# EAGLE design stm32f103c8t6_core_logic_board (EAGLE 8.2.0)
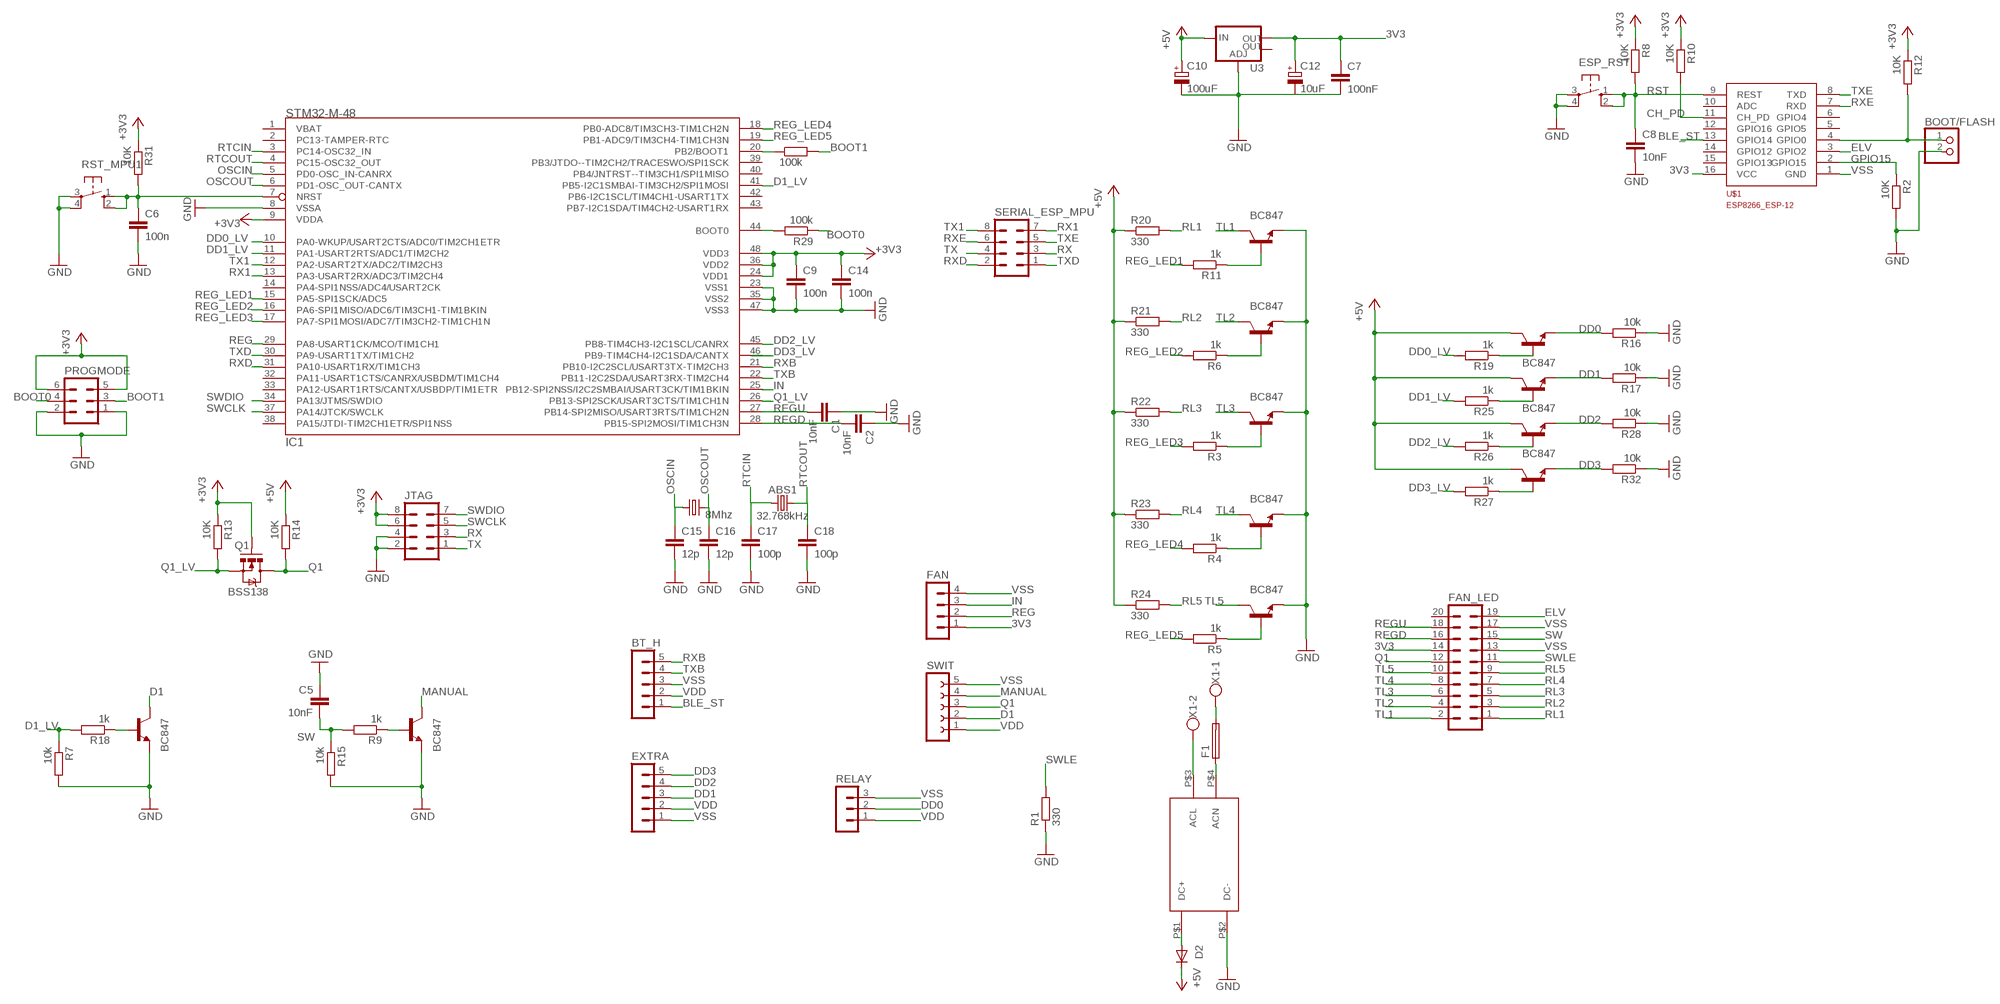
[diagram p0: schematic, sheet 1]

## Parts
ABS1  32.768kHz  CRYSTAL-32.768KHZPTH-2X6  [CRYSTAL-PTH-2X6-CYL]
BOOT/FLASH  PINHD-1X2  [1X02]
BT_H  MA05-1  [MA05-1]
C1  10nF  C-EUC1206  [C1206]
C2  10nF  C-EUC1206  [C1206]
C5  10nF  C-EUC1206  [C1206]
C6  100n  C-EUC1206  [C1206]
C7  100nF  C-EUC1206  [C1206]
C8  10nF  C-EUC1206  [C1206]
C9  100n  C-EUC1206  [C1206]
C10  100uF  CPOL-EU153CLV-0605  [153CLV-0605]
C12  10uF  CPOL-EU153CLV-0405  [153CLV-0405]
C14  100n  C-EUC1206  [C1206]
C15  12p  C-EUC1206  [C1206]
C16  12p  C-EUC1206  [C1206]
C17  100p  C-EUC1206  [C1206]
C18  100p  C-EUC1206  [C1206]
D1_C  BC847  [SOT23]
D1_C1  BC847  [SOT23]
D2  1N4004  [DO41-10]
DD0_C  BC847  [SOT23]
DD1_C  BC847  [SOT23]
DD2_C  BC847  [SOT23]
DD3_C  BC847  [SOT23]
ESP_RST  10-XX  [B3F-10XX]
EXTRA  MA05-1  [MA05-1]
F1  SH22,5A  [SH22,5A]
FAN  MA04-1  [MA04-1]
FAN_LED  MA10-2  [MA10-2]
IC1  STM32-M-48  [LQFP48]
JTAG  MA04-2  [MA04-2]
L1  BC847  [SOT23]
L2  BC847  [SOT23]
L3  BC847  [SOT23]
L4  BC847  [SOT23]
L5  BC847  [SOT23]
PROGMODE  MA03-2  [MA03-2]
Q1  BSS138  MOSFET-NCHANNELSMD  [SOT23-3]
Q2  8Mhz  CRYSTALHC49U-V  [HC49U-V]
R1  330  R-EU_R1206  [R1206]
R2  10K  R-EU_R1206  [R1206]
R3  1k  R-EU_M1206  [M1206]
R4  1k  R-EU_M1206  [M1206]
R5  1k  R-EU_M1206  [M1206]
R6  1k  R-EU_M1206  [M1206]
R7  10k  R-EU_M1206  [M1206]
R8  10K  R-EU_R1206  [R1206]
R9  1k  R-EU_M1206  [M1206]
R10  10K  R-EU_R1206  [R1206]
R11  1k  R-EU_M1206  [M1206]
R12  10K  R-EU_R1206  [R1206]
R13  10K  R-EU_R1206  [R1206]
R14  10K  R-EU_R1206  [R1206]
R15  10k  R-EU_M1206  [M1206]
R16  10k  R-EU_M1206  [M1206]
R17  10k  R-EU_M1206  [M1206]
R18  1k  R-EU_M1206  [M1206]
R19  1k  R-EU_M1206  [M1206]
R20  330  R-EU_R1206  [R1206]
R21  330  R-EU_R1206  [R1206]
R22  330  R-EU_R1206  [R1206]
R23  330  R-EU_R1206  [R1206]
R24  330  R-EU_R1206  [R1206]
R25  1k  R-EU_M1206  [M1206]
R26  1k  R-EU_M1206  [M1206]
R27  1k  R-EU_M1206  [M1206]
R28  10k  R-EU_M1206  [M1206]
R29  100k  R-EU_R1206  [R1206]
R30  100k  R-EU_R1206  [R1206]
R31  10K  R-EU_R1206  [R1206]
R32  10k  R-EU_M1206  [M1206]
RELAY  MA03-1  [MA03-1]
RST_MPU1  10-XX  [B3F-10XX]
SERIAL_ESP_MPU  MA04-2  [MA04-2]
SWIT  FE05-1  [FE05-1]
U3  V_REG_LM1117SOT223  [SOT223]
U$1  ESP8266_ESP-12  [ESP8266-ESP12]
U$2  SDOWN_POWER_SUPPLYPOWER_SUPPLY  [SDOWN_POWER_SUPPLY]
X1  W237-102  [W237-102]

## Nets
3V3: C7.1 C9.1 C12.+ C14.1 FAN.1 FAN_LED.14 IC1.9(VDDA) IC1.24(VDD1) IC1.36(VDD2) IC1.48(VDD3) JTAG.6 JTAG.8 PROGMODE.5 PROGMODE.6 Q1.1(G) R8.1 R10.1 R12.1 R13.1 R31.1 U3.2(OUT) U$1.16(VCC) ; supply symbol labelled +3V3
BLE_ST: BT_H.1 U$1.13(GPIO14)
BOOT0: PROGMODE.4 R29.1
BOOT1: PROGMODE.3 R30.2
CH_PD: R10.2 U$1.11(CH_PD)
D1: D1_C.3(C) SWIT.2
D1_LV: IC1.41(PB5-I2C1SMBAI-TIM3CH2/SPI1MOSI) R7.1 R18.2
DD0: DD0_C.2(E) R16.2 RELAY.2
DD0_LV: IC1.10(PA0-WKUP/USART2CTS/ADC0/TIM2CH1ETR) R19.2
DD1: DD1_C.2(E) EXTRA.3 R17.2
DD1_LV: IC1.11(PA1-USART2RTS/ADC1/TIM2CH2) R25.2
DD2: DD2_C.2(E) EXTRA.4 R28.2
DD2_LV: IC1.45(PB8-TIM4CH3-I2C1SCL/CANRX) R26.2
DD3: DD3_C.2(E) EXTRA.5 R32.2
DD3_LV: IC1.46(PB9-TIM4CH4-I2C1SDA/CANTX) R27.2
ELV: FAN_LED.19 U$1.3(GPIO2)
GPIO0: BOOT/FLASH.1 R12.2 U$1.4(GPIO0)
GPIO15: R2.1 U$1.2(GPIO15)
IN: FAN.3 IC1.25(PB12-SPI2NSS/I2C2SMBAI/USART3CK/TIM1BKIN)
MANUAL: D1_C1.3(C) SWIT.4
N$1: L1.1(B) R11.1
N$2: IC1.44(BOOT0) R29.2
N$3: L2.1(B) R6.1
N$4: L3.1(B) R3.1
N$5: D2.A U$2.P$1(DC+)
N$6: L4.1(B) R4.1
N$7: L5.1(B) R5.1
N$8: F1.2 X1.1
N$9: F1.1 U$2.P$4(ACN)
N$10: U$2.P$3(ACL) X1.2
N$15: D1_C.1(B) R18.1
N$16: IC1.20(PB2/BOOT1) R30.1
N$17: D1_C1.1(B) R9.1
N$23: DD0_C.1(B) R19.1
N$26: DD1_C.1(B) R25.1
N$28: DD2_C.1(B) R26.1
N$31: DD3_C.1(B) R27.1
OSCIN: C15.1 IC1.5(PD0-OSC_IN-CANRX) Q2.1
OSCOUT: C16.1 IC1.6(PD1-OSC_OUT-CANTX) Q2.2
Q1: FAN_LED.12 Q1.3(D) R14.2 SWIT.3
Q1_LV: IC1.26(PB13-SPI2SCK/USART3CTS/TIM1CH1N) Q1.2(S) R13.2
REG: FAN.2 IC1.29(PA8-USART1CK/MCO/TIM1CH1)
REG_LED1: IC1.15(PA5-SPI1SCK/ADC5) R11.2
REG_LED2: IC1.16(PA6-SPI1MISO/ADC6/TIM3CH1-TIM1BKIN) R6.2
REG_LED3: IC1.17(PA7-SPI1MOSI/ADC7/TIM3CH2-TIM1CH1N) R3.2
REG_LED4: IC1.18(PB0-ADC8/TIM3CH3-TIM1CH2N) R4.2
REG_LED5: IC1.19(PB1-ADC9/TIM3CH4-TIM1CH3N) R5.2
REGD: C2.2 FAN_LED.16 IC1.28(PB15-SPI2MOSI/TIM1CH3N)
REGU: C1.2 FAN_LED.18 IC1.27(PB14-SPI2MISO/USART3RTS/TIM1CH2N)
RESET1: C6.1 IC1.7(NRST) R31.2 RST_MPU1.1(S) RST_MPU1.2(S1)
RL1: FAN_LED.1 R20.2
RL2: FAN_LED.3 R21.2
RL3: FAN_LED.5 R22.2
RL4: FAN_LED.7 R23.2
RL5: FAN_LED.9 R24.2
RST: C8.1 ESP_RST.1(S) ESP_RST.2(S1) R8.2 U$1.9(REST)
RTCIN: ABS1.1 C17.1 IC1.3(PC14-OSC32_IN)
RTCOUT: ABS1.2 C18.1 IC1.4(PC15-OSC32_OUT)
RX: JTAG.3 SERIAL_ESP_MPU.3
RX1: IC1.13(PA3-USART2RX/ADC3/TIM2CH4) SERIAL_ESP_MPU.7
RXB: BT_H.5 IC1.21(PB10-I2C2SCL/USART3TX-TIM2CH3)
RXD: IC1.31(PA10-USART1RX/TIM1CH3) SERIAL_ESP_MPU.2
RXE: SERIAL_ESP_MPU.6 U$1.7(RXD)
SW: C5.2 FAN_LED.15 R9.2 R15.1
SWCLK: IC1.37(PA14/JTCK/SWCLK) JTAG.5
SWDIO: IC1.34(PA13/JTMS/SWDIO) JTAG.7
SWLE: FAN_LED.11 R1.2
TL1: FAN_LED.2 L1.3(C)
TL2: FAN_LED.4 L2.3(C)
TL3: FAN_LED.6 L3.3(C)
TL4: FAN_LED.8 L4.3(C)
TL5: FAN_LED.10 L5.3(C)
TX: JTAG.1 SERIAL_ESP_MPU.4
TX1: IC1.12(PA2-USART2TX/ADC2/TIM2CH3) SERIAL_ESP_MPU.8
TXB: BT_H.4 IC1.22(PB11-I2C2SDA/USART3RX-TIM2CH4)
TXD: IC1.30(PA9-USART1TX/TIM1CH2) SERIAL_ESP_MPU.1
TXE: SERIAL_ESP_MPU.5 U$1.8(TXD)
VDD: BT_H.2 C10.+ D2.C DD0_C.3(C) DD1_C.3(C) DD2_C.3(C) DD3_C.3(C) EXTRA.2 R14.1 R20.1 R21.1 R22.1 R23.1 R24.1 RELAY.1 SWIT.1 U3.3(IN) ; supply symbol labelled +5V
VSS: BOOT/FLASH.2 BT_H.3 C1.1 C2.1 C5.1 C6.2 C7.2 C8.2 C9.2 C10.- C12.- C14.2 C15.2 C16.2 C17.2 C18.2 D1_C1.2(E) D1_C.2(E) ESP_RST.3(P) ESP_RST.4(P1) EXTRA.1 FAN.4 FAN_LED.13 FAN_LED.17 IC1.8(VSSA) IC1.23(VSS1) IC1.35(VSS2) IC1.47(VSS3) JTAG.2 JTAG.4 L1.2(E) L2.2(E) L3.2(E) L4.2(E) L5.2(E) PROGMODE.1 PROGMODE.2 R1.1 R2.2 R7.2 R15.2 R16.1 R17.1 R28.1 R32.1 RELAY.3 RST_MPU1.3(P) RST_MPU1.4(P1) SWIT.5 U3.1(ADJ) U$1.1(GND) U$2.P$2(DC-) ; supply symbol labelled GND
Unconnected: FAN_LED.20 IC1.1(VBAT) IC1.2(PC13-TAMPER-RTC) IC1.14(PA4-SPI1NSS/ADC4/USART2CK) IC1.32(PA11-USART1CTS/CANRX/USBDM/TIM1CH4) IC1.33(PA12-USART1RTS/CANTX/USBDP/TIM1ETR) IC1.38(PA15/JTDI-TIM2CH1ETR/SPI1NSS) IC1.39(PB3/JTDO--TIM2CH2/TRACESWO/SPI1SCK) IC1.40(PB4/JNTRST--TIM3CH1/SPI1MISO) IC1.42(PB6-I2C1SCL/TIM4CH1-USART1TX) IC1.43(PB7-I2C1SDA/TIM4CH2-USART1RX) U3.4(OUT) U$1.5(GPIO5) U$1.6(GPIO4) U$1.10(ADC) U$1.12(GPIO16) U$1.14(GPIO12) U$1.15(GPIO13)

## Library data of the parts
ABS1 = SparkFun-Clocks:CRYSTAL-32.768KHZ: 32.768kHz Crystal Frequency: 32.768kHz Frequency Stability: ±20ppm Load Capacitance: 12.5pF (PTH-2X6 & SMD-3.2X1.5), 6pF (SMD-2X6) SparkFun Products: SparkFun BigTime Watch Kit <https://www.sparkfun.com/products/11734> SparkFun nRF52832 Breakout <https://www.sparkfun.com/products/13990> SparkFun Real Time Clock Module <https://www.sparkfun.com/products/12708>; PROD_ID: XTAL-10112
BOOT/FLASH = pinhead:PINHD-1X2: PIN HEADER
BT_H EXTRA = con-lstb:MA05-1: PIN HEADER; OC_FARNELL: unknown; OC_NEWARK: unknown
C1 C2 C5-C9 C14-C18 = rcl:C-EU: CAPACITOR, European symbol
C10 C12 = resistor:CPOL-EU: POLARIZED CAPACITOR, European symbol
D1_C D1_C1 DD0_C DD1_C DD2_C DD3_C L1-L5 = transistor:BC847: NPN TRANSISTOR
D2 = diode:1N4004: DIODE general purpose rectifier, 1 A
ESP_RST RST_MPU1 = switch-omron:10-XX: OMRON SWITCH; MPN: B3F-1000; OC_FARNELL: 176432; OC_NEWARK: 36M3542
F1 = fuse:SH22,5A: FUSE HOLDER grid 22,5mm, isolated cap OGN0031 8201, Schurter (Buerklin); MPN: 0031.7701.11; OC_FARNELL: unknown; OC_NEWARK: 04F1224
FAN = con-lstb:MA04-1: PIN HEADER; OC_FARNELL: unknown; OC_NEWARK: unknown
FAN_LED = con-lstb:MA10-2: PIN HEADER; OC_FARNELL: unknown; OC_NEWARK: unknown
IC1 = pel_stm32:STM32-M-48: STM32F103 Medium Density 48pins
JTAG SERIAL_ESP_MPU = con-lstb:MA04-2: PIN HEADER; OC_FARNELL: unknown; OC_NEWARK: unknown
PROGMODE = con-lstb:MA03-2: PIN HEADER; OC_FARNELL: unknown; OC_NEWARK: unknown
Q1 = SparkFun:MOSFET-NCHANNEL
Q2 = crystal:CRYSTAL: CRYSTAL; OC_FARNELL: 1666969; OC_NEWARK: unknown
R1 R2 R8 R10 R12-R14 R20-R24 R29-R31 = rcl:R-EU_: RESISTOR, European symbol
R3-R7 R9 R11 R15-R19 R25-R28 R32 = resistor:R-EU_: RESISTOR, European symbol
RELAY = con-lstb:MA03-1: PIN HEADER; OC_FARNELL: unknown; OC_NEWARK: unknown
SWIT = con-lsta:FE05-1: FEMALE HEADER; OC_FARNELL: unknown; OC_NEWARK: unknown
U3 = SparkFun-PowerIC:V_REG_LM1117: Voltage Regulator LM1117 Standard adjustable voltage regulator but in SMD form. Spark Fun Electronics SKU : COM-00595; PROD_ID: VREG-08170
U$1 = ESP8266-ESP12:ESP8266_ESP-12
U$2 = SDOWN_POWER_SUPPLY:SDOWN_POWER_SUPPLY
X1 = con-wago-500:W237-102: WAGO SCREW CLAMP; MPN: 237-102; OC_FARNELL: unknown; OC_NEWARK: 70K9898

## Net classes
0 default: clearance 0.205 mm
1 POWER: clearance 0.205 mm to class 0, clearance 0.205 mm
2 GND: clearance 0.205 mm to class 0, clearance 0.205 mm to class 1, clearance 0.205 mm

## Board
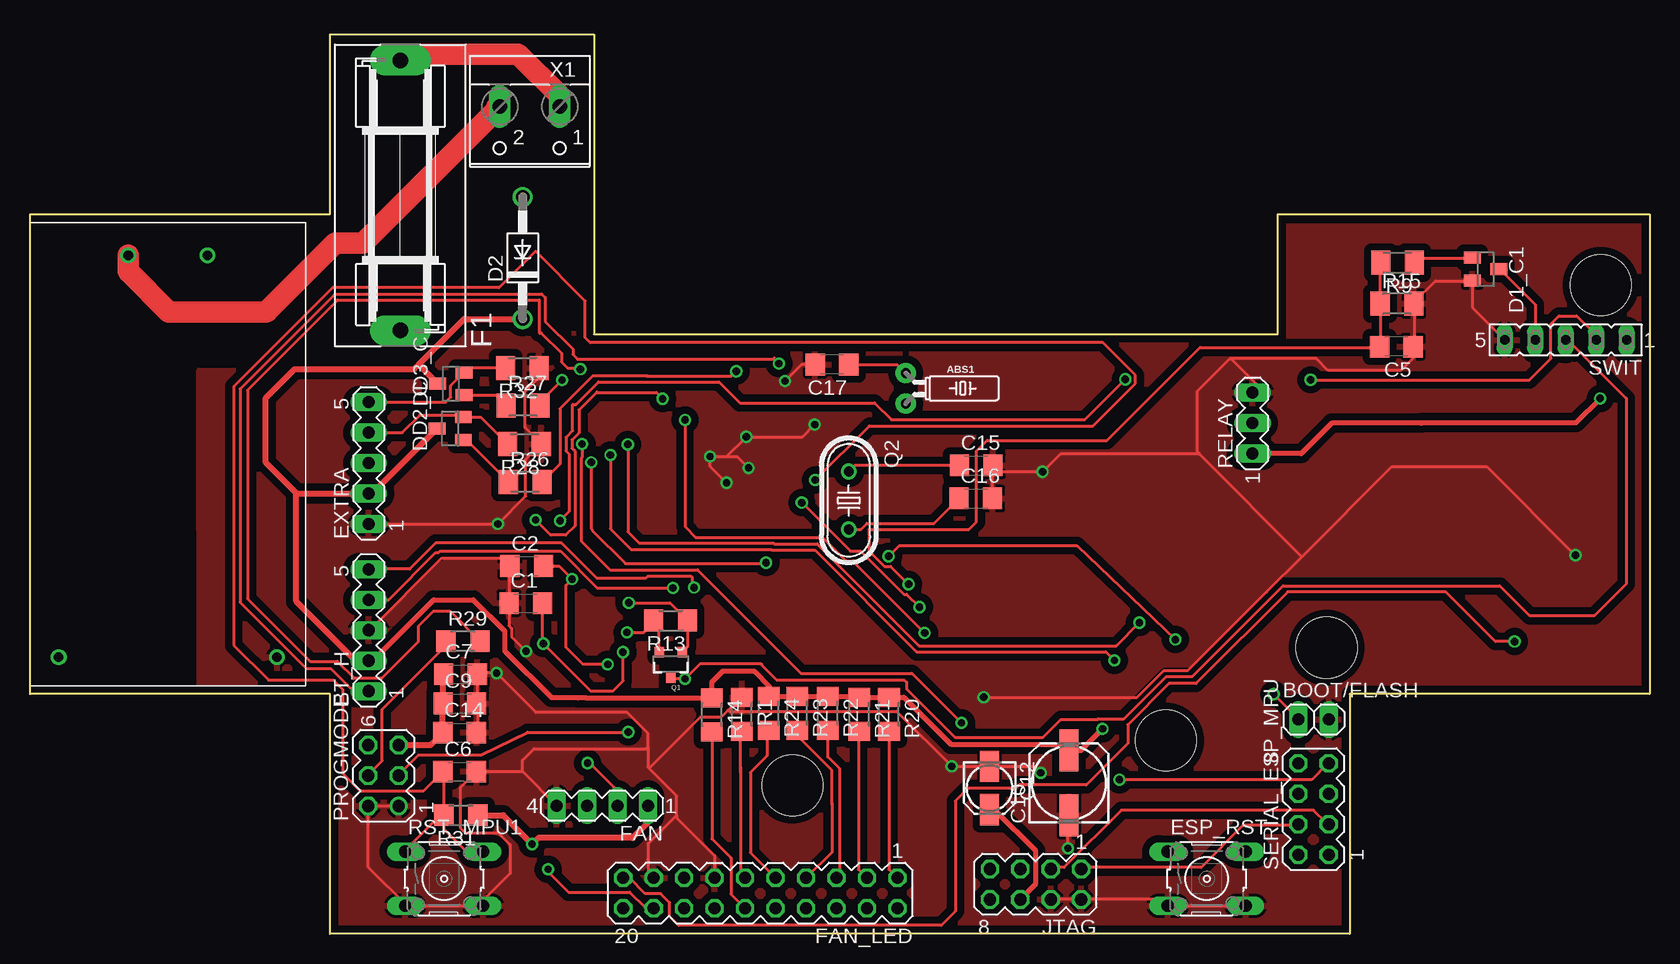
[diagram p1: board, top side]
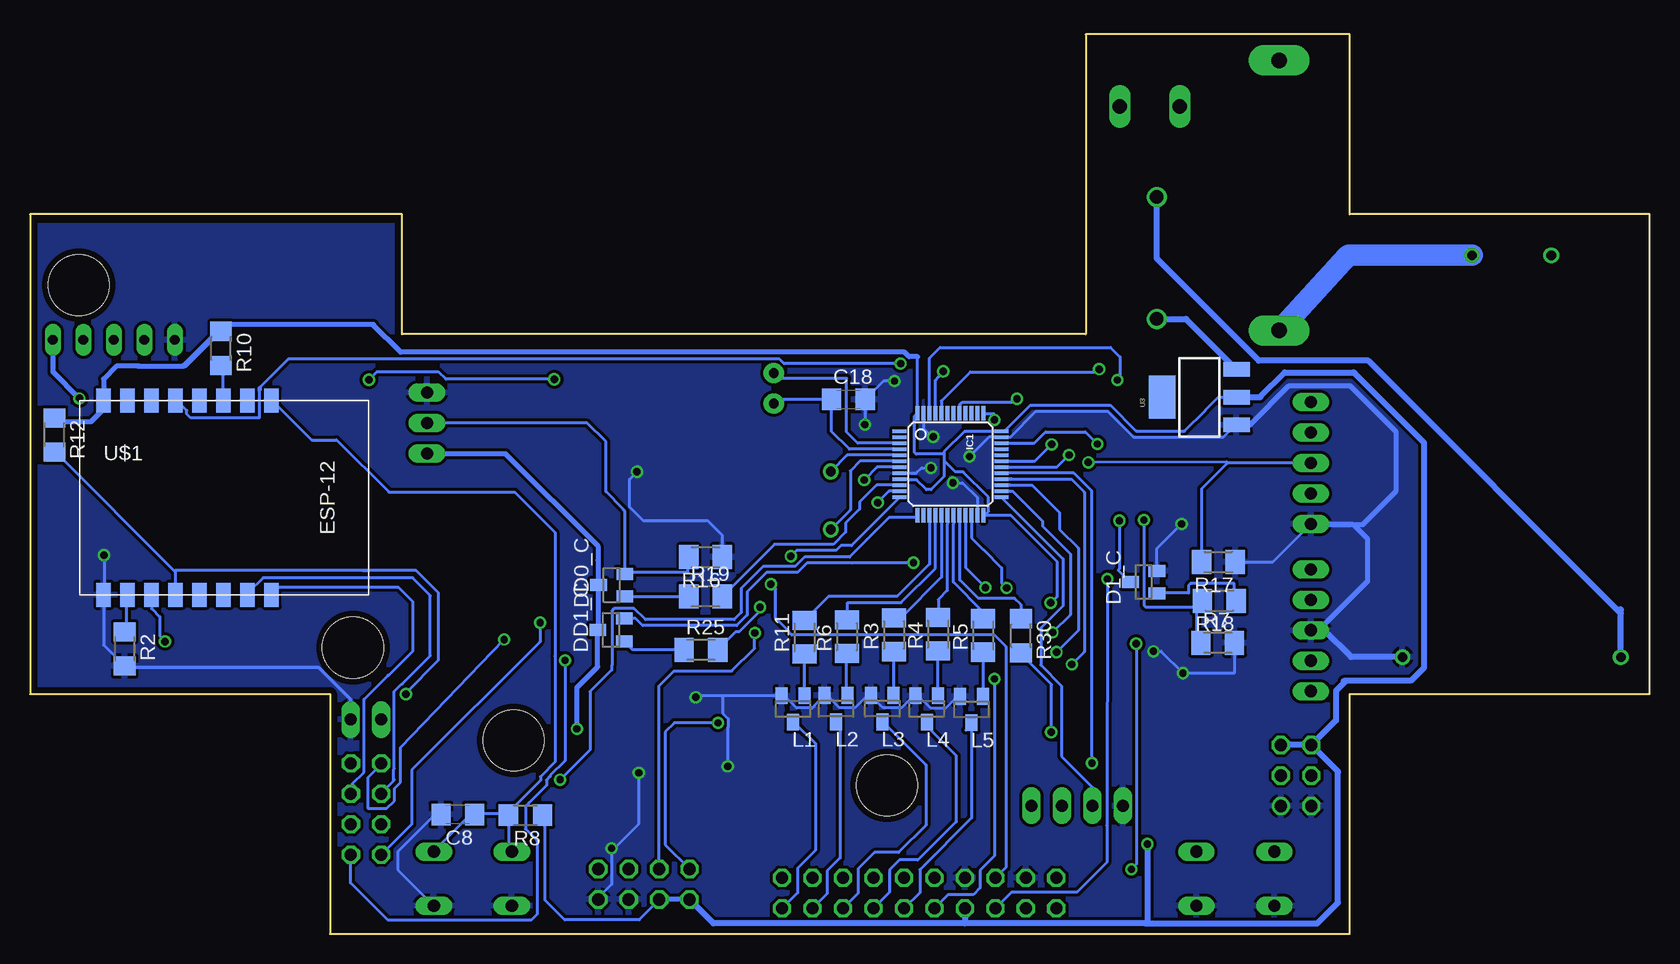
[diagram p2: board, bottom side, seen from below]

Size 135 x 75 mm. Coordinates in mm from the lower left corner, seen from the top.
Outline: 25,0 25,20 0,20 0,60 25,60 25,75 47,75 47,50 104,50 104,60 135,60 135,20 110,20 110,0 25,0
Copper layers (1*16): Top 0.035mm / dielectric 1.5mm / Bottom 0.035mm
Design rules "default *": minimum track width 10mil, minimum drill 24mil, track to track 10mil, track to pad 8mil, pad to pad 8mil, via to via 8mil, smd to smd 6mil, copper to edge 20mil, drill to drill 10mil, minimum pad ring 10mil, minimum via ring 8mil, stop-mask expansion 4mil, vias tented up to drill 0mil, thermal gap 10mil
Holes 5.08 mm at 130.94,54.1 108.08,23.88 63.55,12.4 94.69,16.13

### Footprints (pad centres in the part's own frame; a part is rotated, then mirrored left to right if it is on the bottom)
CRYSTAL-PTH-2X6-CYL = drill 0.813 pad 1.676: 1 -1.27,0; 2 1.27,0
1X02 = drill 1.016 long: 1 -1.27,0; 2 1.27,0
MA05-1 = drill 1.016 long: 1 -5.08,0; 2 -2.54,0; 3 0,0; 4 2.54,0; 5 5.08,0
C1206 = smd 1.6 x 1.8: 1 -1.4,0; 2 1.4,0
153CLV-0605 = smd 3.5 x 1.6: + 2.7,0; - -2.7,0
153CLV-0405 = smd 2.6 x 1.6: + 1.8,0; - -1.8,0
SOT23 = smd 1 x 1.4: 1 -0.95,-1.1; 2 0.95,-1.1; 3 0,1.1
DO41-10 = drill 1.118: A 5.08,0; C -5.08,0
B3F-10XX = drill 1.016 long: 1 -3.251,2.261; 2 3.251,2.261; 3 -3.251,-2.261; 4 3.251,-2.261
SH22,5A = drill 1.321 pad 2.54 long: 1 -11.252,0; 2 11.252,0
MA04-1 = drill 1.016 long: 1 -3.81,0; 2 -1.27,0; 3 1.27,0; 4 3.81,0
MA10-2 = drill 1.016 octagon: 1 -11.43,-1.27; 2 -11.43,1.27; 3 -8.89,-1.27; 4 -8.89,1.27; 5 -6.35,-1.27; 6 -6.35,1.27; 7 -3.81,-1.27; 8 -3.81,1.27; 9 -1.27,-1.27; 10 -1.27,1.27; 11 1.27,-1.27; 12 1.27,1.27; 13 3.81,-1.27; 14 3.81,1.27; 15 6.35,-1.27; 16 6.35,1.27; 17 8.89,-1.27; 18 8.89,1.27; 19 11.43,-1.27; 20 11.43,1.27
LQFP48 = smd 0.3 x 1.2: 1 -2.75,-4.25; 2 -2.25,-4.25; 3 -1.75,-4.25; 4 -1.25,-4.25; 5 -0.75,-4.25; 6 -0.25,-4.25; 7 0.25,-4.25; 8 0.75,-4.25; 9 1.25,-4.25; 10 1.75,-4.25; 11 2.25,-4.25; 12 2.75,-4.25; 25 2.75,4.25; 26 2.25,4.25; 27 1.75,4.25; 28 1.25,4.25; 29 0.75,4.25; 30 0.25,4.25; 31 -0.25,4.25; 32 -0.75,4.25; 33 -1.25,4.25; 34 -1.75,4.25; 35 -2.25,4.25; 36 -2.75,4.25 | smd 1.2 x 0.3: 13 4.25,-2.75; 14 4.25,-2.25; 15 4.25,-1.75; 16 4.25,-1.25; 17 4.25,-0.75; 18 4.25,-0.25; 19 4.25,0.25; 20 4.25,0.75; 21 4.25,1.25; 22 4.25,1.75; 23 4.25,2.25; 24 4.25,2.75; 37 -4.25,2.75; 38 -4.25,2.25; 39 -4.25,1.75; 40 -4.25,1.25; 41 -4.25,0.75; 42 -4.25,0.25; 43 -4.25,-0.25; 44 -4.25,-0.75; 45 -4.25,-1.25; 46 -4.25,-1.75; 47 -4.25,-2.25; 48 -4.25,-2.75
MA04-2 = drill 1.016 octagon: 1 -3.81,-1.27; 2 -3.81,1.27; 3 -1.27,-1.27; 4 -1.27,1.27; 5 1.27,-1.27; 6 1.27,1.27; 7 3.81,-1.27; 8 3.81,1.27
MA03-2 = drill 1.016: 1 -2.54,-1.27 | drill 1.016 octagon: 2 -2.54,1.27; 3 0,-1.27; 4 0,1.27; 5 2.54,-1.27; 6 2.54,1.27
SOT23-3 = smd 0.8 x 0.9: 1 -0.95,-1; 2 0.95,-1; 3 0,1.1
HC49U-V = drill 0.813: 1 -2.413,0; 2 2.413,0
R1206 = smd 1.6 x 1.803: 1 -1.422,0; 2 1.422,0
M1206 = smd 1.6 x 2: 1 -1.4,0; 2 1.4,0
MA03-1 = drill 1.016 long: 1 -2.54,0; 2 0,0; 3 2.54,0
FE05-1 = drill 0.813 long: 1 -5.08,0; 2 -2.54,0; 3 0,0; 4 2.54,0; 5 5.08,0
SOT223 = smd 1.219 x 2.235: 1 -2.311,-3.099; 2 0,-3.099; 3 2.311,-3.099 | smd 3.6 x 2.2: 4 0,3.099
ESP8266-ESP12 = smd 2 x 1.2: 1 16.2,2; 2 16.2,4; 3 16.2,6; 4 16.2,8; 5 16.2,10; 6 16.2,12; 7 16.2,14; 8 16.2,16; 9 0,16; 10 0,14; 11 0,12; 12 0,10; 13 0,8; 14 0,6; 15 0,4; 16 0,2
SDOWN_POWER_SUPPLY = drill 0.8: P$1 2.4,2.4; P$2 20.6,2.4; P$3 8.2,35.9; P$4 14.8,35.9
W237-102 = drill 1.194 long: 1 -2.5,-1.27; 2 2.5,-1.27

### Placement (x,y rotation side)
ABS1  73,45.49 270 top
BOOT/FLASH  107.01,17.88 0 top
BT_H  28.23,25.32 90 top
C1  41.33,27.58 0 top
C2  41.4,30.68 0 top
C5  113.89,48.97 180 top
C6  35.81,13.54 0 top
C7  35.89,21.67 0 top
C8  99.34,9.96 180 bottom
C9  35.84,19.23 0 top
C10  86.61,12.6 90 top
C12  79.98,12.17 270 top
C14  35.81,16.79 0 top
C15  78.87,39.07 0 top
C16  78.84,36.32 0 top
C17  66.85,47.47 180 top
C18  66.78,44.58 0 bottom
D1_C  42.16,29.34 90 bottom
D1_C1  121.34,55.42 270 top
D2  41.07,56.36 90 top
DD0_C  86.51,29.08 90 bottom
DD1_C  86.56,25.35 90 bottom
DD2_C  35.03,42.14 90 top
DD3_C  35.08,45.87 90 top
ESP_RST  98.09,4.61 0 top
EXTRA  28.23,39.26 90 top
F1  30.87,61.58 90 top
FAN  47.7,10.69 180 top
FAN_LED  60.88,3.41 180 top
IC1  58.27,39.17 270 bottom
JTAG  83.82,4.15 180 top
L1  71.4,18.77 180 bottom
L2  67.82,18.8 180 bottom
L3  63.96,18.8 180 bottom
L4  60.25,18.77 180 bottom
L5  56.52,18.72 180 bottom
PROGMODE  29.46,13.21 90 top
Q1  53.42,22.5 180 top
Q2  68.25,36.14 270 top
R1  59.33,18.31 270 top
R2  127.1,23.77 270 bottom
R3  62.99,24.94 90 bottom
R4  59.31,24.99 90 bottom
R5  55.55,24.89 90 bottom
R6  66.9,24.79 90 bottom
R7  35.99,24.28 0 bottom
R8  93.7,9.91 180 bottom
R9  114,55.98 180 top
R10  119.08,48.82 270 bottom
R11  70.43,24.74 90 bottom
R12  132.97,41.61 270 bottom
R13  53.39,26.14 180 top
R14  56.85,18.26 270 top
R15  113.94,52.55 0 top
R16  78.69,31.42 180 bottom
R17  35.94,31.01 180 bottom
R18  35.86,27.79 180 bottom
R19  78.69,28.14 0 bottom
R20  71.6,18.31 270 top
R21  69.11,18.31 270 top
R22  66.5,18.39 270 top
R23  63.96,18.39 270 top
R24  61.57,18.39 270 top
R25  79.07,23.7 0 bottom
R26  41.27,37.69 0 top
R27  41.1,44.04 0 top
R28  41.22,40.84 180 top
R29  36.09,24.41 0 top
R30  52.4,24.87 270 bottom
R31  35.92,9.91 180 top
R32  41.05,47.19 180 top
RELAY  101.91,42.6 90 top
RST_MPU1  34.52,4.61 0 top
SERIAL_ESP_MPU  106.99,10.42 90 top
SWIT  128.02,49.53 180 top
U3  37.52,44.75 90 bottom
U$1  130.86,44.48 270 bottom
U$2  -0.01,20.69 0 top
X1  41.66,67.72 180 top

### Tracks (layer width: path | path; a pad name or v marks a point on that pad's centre or on a via)
3V3  (via drill 0.61)
  Top 0.254: 34.41,19.17 arc-45 C9.1 | 34.44,21.56 arc-45 34.48,21.65 C7.1 | R13.1 54.89,26.21 | R13.1 54.81,23.95 Q1.1 | v49.91,27.61 53.34,27.61 R13.1
  Top 0.406: C12.+ 80.36,10.37 arc-45 80.45,10.33 83.8,6.99 83.8,4.17 arc-45 83.76,4.08 JTAG.6
  Top 0.508: PROGMODE.5 33.32,15.75 arc45 33.41,15.79 C14.1 34.41,19.17 arc-45 C9.1 34.44,22.15 arc45 34.4,22.24 34.39,22.25 34.39,21.82 arc45 34.43,21.73 C7.1 | FAN.1 51.51,9.32 50.19,8 42.37,8 v41.86,7.49 39.45,9.91 R31.1
  Bottom 0.254: 61.01,48.13 IC1.48 61.12,43.34 61.29,43.17 61.29,40.16 61.14,40.01 58.8,40.01 | U3.2 35.94,44.76 36.98,43.71 36.98,43.69 38.75,41.92 38.77,41.94 42.8,41.94 44.96,44.09 51.61,44.09 53.79,41.92 IC1.36 54.13,41.91 57.1,41.91 58.8,40.21 58.8,40.01 | JTAG.6 82.55,2.84 84.23,1.17 90.42,1.17 92.08,2.82 92.08,9.7 R8.1 | 55.11,35.22 55.4,34.92 IC1.24 53.26,34.92 49.4,31.06 49.4,28.12 v49.91,27.61 | 55.11,35.22 55.09,35.24 | IC1.9 62.5,37.94 61.78,37.94 61.72,37.87 61.09,37.87 60.27,37.06 59.89,37.06 58.8,38.15 58.8,39.47 | 58.8,40.01 58.8,39.47 | 55.11,35.22 55.11,36.41 57.23,38.53 57.86,38.53 58.8,39.47
  Bottom 0.406: JTAG.8 JTAG.6 | R10.1 119.33,50.24 122.16,47.41 arc45 122.25,47.37 | 122.25,47.37 125.91,47.37 arc-45 126,47.33 127.8,47.33 128.85,46.28 U$1.16 128.86,43.76 129.92,42.7 132.64,42.7 R12.1 | 122.25,47.37 122.15,47.37 arc-45 122.06,47.41 118.64,50.83 106.43,50.83 | 106.43,50.83 arc45 106.34,50.79 | 61.01,48.13 61.71,48.13 62.09,48.52 104.12,48.52 106.43,50.83
  Bottom 0.508: U3.2 32.51,44.76 arc-45 32.42,44.79 30.4,46.81 24.69,46.81 arc45 24.6,46.77 18.8,40.97 18.8,22.28 arc45 18.83,22.19 19.91,21.11 25.4,21.11 | 25.4,21.11 arc-45 25.49,21.07 | PROGMODE.6 PROGMODE.5 | PROGMODE.6 26,13.55 arc45 25.96,13.46 25.96,2.62 27.65,0.93 arc45 27.74,0.89 42.04,0.89 | 25.4,21.11 25.4,21.01 26.14,20.27 26.14,17.8 PROGMODE.6 | JTAG.8 78.02,0.89 57.1,0.89 | 42.04,0.89 57.1,0.89 | FAN_LED.14 57.07,0.92 57.1,0.89 | v41.86,7.49 41.86,1.07 42.04,0.89
BLE_ST  (via drill 0.61)
  Top 0.254: 28.1,20.32 BT_H.1 28.13,20.34 26.85,20.34 25.07,22.12 23.04,22.12 17.5,27.66 17.5,45.44 25.43,53.37 42.65,53.37 42.95,53.07 42.95,51.08 45.26,48.77 45.26,48.31 45.64,47.93 61.92,47.93 | 62.03,48.04 61.92,47.93 | 61.92,47.93 62.05,47.93 v62.43,47.55
  Bottom 0.254: 115.89,45.26 115.89,45.56 | 115.89,45.26 115.89,43.02 121.6,43.02 121.92,43.34 121.92,43.66 122.71,44.45 U$1.13 | 62.71,47.84 v62.43,47.55 72.14,47.55 72.52,47.93 113.47,47.93 115.79,45.61 115.79,45.36 115.89,45.26
BOOT0
  Top 0.254: R29.1 34.61,24.29 34.61,23.97 29.37,18.73 29.37,14.45 28.26,13.34 PROGMODE.4
BOOT1  (via drill 0.61)
  Top 0.254: v49.87,16.83 41.46,16.83 37.62,14.92 32.38,14.92 30.8,13.34 PROGMODE.3
  Bottom 0.254: v49.87,16.83 49.85,20.8 52.39,23.34 R30.2
CH_PD
  Bottom 0.254: R10.2 119.06,47.31 118.9,47.15 118.9,44.61 U$1.11
D1  (via drill 0.61)
  Top 0.254: v106.75,46.2 106.78,46.18 124.97,46.18 126.77,47.98 126.77,50.85 127.46,51.54 128.93,51.54 130.38,50.09 130.38,49.71 SWIT.2 | v44.19,34.45 44.17,34.47 44.92,35.22 44.92,40.04 44.68,40.28 44.68,41.4 45.24,41.96 45.24,44.15 45.51,44.15 47.39,46.03 57.43,46.03 59.18,44.27 70.41,44.27 71.81,42.88 87.93,42.88 v91.3,46.25
  Bottom 0.254: D1_C.3 43.34,29.37 44.29,30.32 44.19,30.42 v44.19,34.45 | v91.3,46.25 100.32,46.25 100.94,46.86 106.09,46.86 v106.75,46.2
D1_LV  (via drill 0.61)
  Top 0.254: v42.14,34.52 43.41,33.25 44.65,33.25 45.43,34.03 45.43,40.25 45.19,40.49 45.19,41.19 45.77,41.78 45.77,43.69 47.23,45.15 | 47.27,45.19 47.23,45.15 | 47.23,45.15 52.21,45.15 v52.73,44.63
  Bottom 0.254: IC1.41 57.5,43.44 57.5,44.15 57.3,44.35 53.01,44.35 v52.73,44.63 | v42.14,34.52 42.14,27.41 42.01,27.28 37.77,27.28 | 37.77,27.28 R18.2 | 37.77,27.28 37.77,24.66 R7.1
DD0
  Bottom 0.254: DD0_C.2 85.41,30.16 80.17,30.16 80.17,31.27 R16.2 | 85.57,30.16 DD0_C.2 | DD0_C.2 85.41,35.27 85.55,35.4 85.55,35.43 87,36.88 87,41.05 88.54,42.6 RELAY.2 | RELAY.2
DD0_LV
  Bottom 0.254: R19.2 72.95,32.49 68.02,32.49 67,33.51 67,34.26 65.84,35.43 65.84,36.02 64.44,37.42 IC1.10
DD1  (via drill 0.61)
  Top 0.254: v46.78,39.32 46.78,33.79 46.86,33.71 46.86,33.66 49.63,30.89 61.29,30.89 v61.35,30.95
  Bottom 0.254: EXTRA.3 35.19,39.26 | 35.19,39.26 37.34,37.11 R17.2 | v46.78,39.32 35.24,39.37 35.19,39.26 | v61.35,30.95 66.44,30.95 66.47,30.92 70.24,30.92 71.01,30.15 73.59,30.15 75.21,28.52 75.21,26.59 76.09,25.7 83.92,25.7 84.51,26.3 DD1_C.2
DD1_LV  (via drill 0.61)
  Top 0.254: v64.34,35.97 68.38,31.93 69.23,31.93 72.84,28.32 73.08,28.32 v74.14,27.25
  Bottom 0.254: IC1.11 63.39,36.92 v64.34,35.97 | 77.64,23.72 R25.2 76.17,25.2 75.88,25.2 74.14,26.93 v74.14,27.25
DD2
  Top 0.254: EXTRA.4 31.03,41.8 32.51,43.28 35.93,43.28 DD2_C.2 37.58,43.09 R28.2
DD2_LV  (via drill 0.61)
  Top 0.254: R26.2 44.17,39.19 44.17,43.8 46.91,46.53 51.38,46.53 | 51.52,46.53 51.38,46.53 | 51.38,46.53 58.5,46.53 v58.88,46.91
  Bottom 0.254: IC1.45 59.52,46.17 v58.88,46.91
DD3
  Top 0.254: EXTRA.5 34.66,44.34 35.08,44.76 35.08,45.72 DD3_C.2 36.55,47.19 R32.2
DD3_LV  (via drill 0.61)
  Top 0.254: 42.86,44.45 42.55,44.13 R27.2 42.5,44.31 v44.36,46.18
  Bottom 0.254: 60.01,43.5 IC1.46 60.02,48.01 59.13,48.9 44.93,48.9 44.15,48.11 44.15,46.39 v44.36,46.18
ELV  (via drill 0.61)
  Top 0.254: v123.75,24.38 122.15,24.38 118.01,28.52 104.85,28.52 97.21,20.88 94.95,20.88 91.52,17.44 91.52,15.88 88.06,12.42 82.45,12.42 82.17,12.14 78.18,12.14 77.14,11.1 77.14,1.91 75.96,0.72 | 75.96,0.72 75.95,0.71 | 75.96,0.72 54.06,0.72 53.31,1.47 53.31,2.62 52.58,3.35 51.28,3.35 50.01,4.62 49.5,4.62 FAN_LED.19
  Bottom 0.254: U$1.3 124.86,27.12 124.18,26.44 124.18,24.82 v123.75,24.38
GPIO0  (via drill 0.61)
  Top 0.254: v103.66,20 105.73,17.94 BOOT/FLASH.1
  Bottom 0.254: 122.95,30.24 122.87,30.16 122.87,28.42 U$1.4 | 122.95,30.24 132.87,40.16 R12.2 | 107.29,30.32 122.87,30.32 122.95,30.24 | 107.29,30.32 106.68,30.32 | v103.66,20 103.66,20.11 100.94,22.84 100.94,28.45 102.82,30.33 107.28,30.33 107.29,30.32
GPIO15
  Bottom 0.254: R2.1 127,25.24 127,28.26 U$1.2
IN
  Bottom 0.254: IC1.25 53.98,36.35 48.9,31.27 48.9,27.36 50.75,25.5 50.75,22.42 49.01,20.68 49.01,18.14 | 49.01,18.14 49.01,17.97 | 49.01,18.14 49.01,14.82 46.38,12.19 46.38,10.74 FAN.3
MANUAL
  Top 0.254: D1_C1.3 122.53,55.42 125.48,52.48 SWIT.4
N$1
  Bottom 0.254: L1.1 70.48,20 70.48,23.34 R11.1
N$2  (via drill 0.61)
  Top 0.254: R29.2 35,26.92 33.63,26.92 32.38,25.68 32.38,24.38 29.34,21.34 27.02,21.34 | v45.87,47.09 45.8,47.17 44.83,47.17 44.3,47.7 44.3,48.44 42.62,50.11 42.44,50.11 42.44,52.86 25.64,52.86 18.13,45.35 18.13,27.95 23.34,22.73 25.62,22.73 27.02,21.34 | 26.92,21.31 26.99,21.31 27.02,21.34
  Bottom 0.254: IC1.44 59.03,44.45 56.62,46.86 46.1,46.86 v45.87,47.09
N$3
  Bottom 0.254: L2.1 66.99,20 66.99,23.34 R6.1
N$4
  Bottom 0.254: L3.1 63.02,20 63.02,23.5 R3.1
N$5
  Bottom 0.508: U$2.P$1 2.39,26.75 | 2.39,26.75 2.39,27 arc-45 2.43,27.09 | 41.01,61.47 arc-45 D2.A 41.07,56.31 32.56,47.8 23.45,47.8 2.39,26.75
N$6
  Bottom 0.254: L4.1 59.37,20 59.37,23.5 R4.1
N$7
  Bottom 0.254: L5.1 55.56,19.84 55.56,23.34 R5.1
N$8
  Top 1.778: X1.1 44.16,69.78 arc45 44.09,69.96 40.69,73.36 30.91,73.36 arc45 F1.2
N$9
  Bottom 1.778: U$2.P$4 25.01,56.59 arc-45 25.19,56.52 F1.1
N$10
  Top 1.778: 38.9,68.92 arc-45 39.08,68.99 X1.2 27.85,57.68 arc-45 27.67,57.61 25.45,57.61 19.79,51.94 arc-45 19.61,51.87 11.58,51.87 8.26,55.19 arc-45 8.19,55.36 U$2.P$3
N$15
  Bottom 0.254: D1_C.1 40.96,28.42 38.42,28.42 38.42,29.05 38.26,29.21 34.61,29.21 34.61,27.94 R18.1
N$16
  Bottom 0.254: R30.1 52.4,27.46 52.93,27.99 55.96,27.99 57.48,29.52 57.48,34.16 57.5,34.18 57.5,34.9 IC1.20
N$17
  Top 0.254: D1_C1.1 120.17,56.36 115.73,56.36 115.41,56.04 R9.1
N$23
  Bottom 0.254: DD0_C.1 85.41,28.1 80.17,28.1 R19.1
N$26
  Bottom 0.254: R25.1 84.76,23.7 DD1_C.1
N$28
  Top 0.254: DD2_C.1 36.38,41.19 R26.1
N$31
  Top 0.254: DD3_C.1 38.82,44.92 R27.1
OSCIN
  Top 0.254: Q2.1 68.26,38.58 68.75,39.06 C15.1
  Bottom 0.254: IC1.5 66.89,39.92 Q2.1
OSCOUT
  Top 0.254: 68.26,33.81 Q2.2 69.26,33.73 69.77,34.24 75.36,34.24 C16.1
  Bottom 0.254: IC1.6 65.81,39.42 66.62,38.61 66.62,35.36 Q2.2
Q1  (via drill 0.61)
  Top 0.254: Q1.3 53.5,21.27 v54.61,21.27 55.88,22.54 60.93,22.54 60.97,22.5 60.97,22.44 62.23,21.18 72.87,21.18 73.08,20.98 73.08,20.42 77.09,16.41 84.45,16.41 85.93,17.88 89.01,17.88 89.06,17.93 91.19,17.93 94.72,21.46 96.88,21.46 104.44,29.03 122.5,29.03 125.02,26.52 130.4,26.52 133.07,29.18 133.07,44.65 128.19,49.53 SWIT.3 127.64,49.53 | 56.83,16.83 R14.2 56.84,7.92 58.42,6.35 58.42,3.33 FAN_LED.12
  Bottom 0.254: 54.45,21.11 v54.61,21.27 54.61,6.5 55.8,5.31 55.8,3.83 56.36,3.28 58.47,3.28 FAN_LED.12
Q1_LV  (via drill 0.61)
  Top 0.254: 52.07,26.04 52.39,25.72 52.39,23.65 Q1.2 | 52.07,26.04 R13.2 51.92,26.19 | v49.76,25.15 51.18,25.15 52.07,26.04
  Bottom 0.254: 53.38,36.92 IC1.26 53.1,36.92 50.6,34.42 50.6,34.01 48.28,31.7 48.28,26.62 v49.76,25.15
REG  (via drill 0.61)
  Top 0.254: v46.48,14.25 46.66,14.25 48.92,11.99 48.92,10.74 FAN.2
  Bottom 0.254: IC1.29 53.98,38.42 53.96,38.43 47.98,38.43 46.51,36.96 46.51,14.28 v46.48,14.25
REG_LED1
  Bottom 0.254: IC1.15 60.02,30.84 62.71,28.14 68.43,28.14 R11.2
REG_LED2
  Bottom 0.254: IC1.16 59.53,34.77 59.53,30.48 62.39,27.62 66.83,27.62 66.83,26.19 R6.2
REG_LED3
  Bottom 0.254: R3.2 62.97,26.36 62.41,26.36 59.02,29.75 IC1.17
REG_LED4
  Bottom 0.254: IC1.18 58.52,34.2 58.55,34.17 58.55,28.63 59.28,27.89 59.28,26.42 R4.2
REG_LED5
  Bottom 0.254: R5.2 55.55,26.85 58.04,29.34 58.04,34.18 58.04,34.9 | 58.04,34.9 58.03,34.91 | IC1.19 58.04,34.9
REGD  (via drill 0.61)
  Top 0.254: C2.2 44.1,30.68 v45.19,29.59 44.68,29.08 44.68,23.9 46.1,22.48 v48.16,22.48
  Bottom 0.254: v45.19,29.59 45.24,9.05 45.24,5.96 47.73,3.48 53.19,3.48 FAN_LED.16 | 53.13,37.92 IC1.28 48.2,37.92 47.12,36.83 47.12,23.52 v48.16,22.48
REGU  (via drill 0.61)
  Top 0.254: C1.2 42.73,24.27 v42.79,24.21 46.72,20.27 48.62,20.27 49.45,21.11 49.45,23.47 v49.43,23.5 | 43.18,5.33 v43.18,5.4 43.18,5.18 44.88,3.48 49.99,3.48 51.26,2.21 51.92,2.21 FAN_LED.18
  Bottom 0.254: 53.27,37.42 IC1.27 51.46,37.42 49.17,35.13 49.17,33.73 47.62,32.18 47.62,25.3 v49.43,23.5 | v43.18,5.4 42.79,5.79 v42.79,24.21
RESET1  (via drill 0.61)
  Top 0.254: RST_MPU1.1 31.27,6.99 34.2,9.91 R31.2 | RST_MPU1.2 37.62,6.99 37.55,6.91 36.37,6.91 34.49,8.79 R31.2 | v65.46,37.85 69.98,42.37 88.61,42.37 92.14,45.9 92.14,46.59 89.45,49.29 46.7,49.29 46.29,49.7 46.29,52.77 42.14,56.92 39.09,53.87 25.21,53.87 16.99,45.65 16.99,24.08 19.89,21.18 25.27,21.18 26.06,20.4 26.06,13.41 27.53,11.94 32.81,11.94 34.15,13.27 | 34.15,13.27 C6.1 | R31.2 34.49,12.93 34.15,13.27
  Bottom 0.254: IC1.7 64.39,38.92 v65.46,37.85
RL1
  Top 0.254: R20.2 71.6,16.83 71.6,5.39 FAN_LED.1
RL2
  Top 0.254: R21.2 69.06,16.83 69.06,5.39 FAN_LED.3
RL3
  Top 0.254: R22.2 66.52,16.83 66.52,14.76 67.47,13.81 67.47,4.92 FAN_LED.5
RL4
  Top 0.254: 66.83,10.79 66.83,10.95 | 66.83,10.95 66.83,13.65 63.98,16.51 63.98,16.83 R23.2 | 66.83,10.95 66.83,6.82 FAN_LED.7
RL5
  Top 0.254: R24.2 61.44,16.83 61.44,14.85 60.05,13.46 60.05,6.78 FAN_LED.9
RST
  Bottom 0.254: 95.25,10 97.79,10 C8.1 | 95.25,10 R8.2 95.09,9.84 95.09,7.14 94.93,6.99 ESP_RST.1 | 97.95,10.32 97.95,10 C8.1 | U$1.9 114.78,44.45 111.52,41.19 | 97.95,10.32 101.28,6.99 ESP_RST.2 | 97.95,10.32 C8.1 | 111.5,41.17 111.52,41.19 | 95.25,10 92.46,12.79 92.46,13.11 91.24,14.33 91.24,23.16 91.24,33.48 94.59,36.83 105.08,36.83 109.44,41.19 111.52,41.19
RTCIN
  Top 0.254: 68.26,47.47 C17.1 72.29,47.47 ABS1.1
  Bottom 0.254: IC1.3 66.01,40.92 66.93,41.83 66.93,46.33 70.76,46.33 | 70.76,46.33 70.92,46.33 | 70.76,46.33 72.57,46.33 ABS1.1
RTCOUT
  Bottom 0.254: IC1.4 66.71,40.42 68.2,41.91 68.2,44.55 C18.1 72.64,44.58 ABS1.2
RX
  Top 0.254: JTAG.3 85.25,5.56 86.2,5.56 90.96,10.32 107,10.32 108.11,9.21 SERIAL_ESP_MPU.3
RX1  (via drill 0.61)
  Top 0.254: v90.81,12.86 106.84,12.86 108.11,14.13 SERIAL_ESP_MPU.7
  Bottom 0.254: IC1.13 61.12,34.77 63.34,34.77 66.67,31.43 70.45,31.43 71.22,30.66 73.89,30.66 75.72,28.83 75.72,26.8 76.3,26.21 83.71,26.21 84.63,27.13 86.3,27.13 86.5,26.94 86.5,22.41 86.52,22.38 86.52,22.02 88.32,20.22 88.32,15.35 v90.81,12.86
RXB  (via drill 0.61)
  Top 0.254: BT_H.5 28.26,30.43 31.65,30.43 33.81,32.59 44.32,32.59 47.24,29.67 51.34,29.67 51.51,29.84 55.09,29.84 55.17,29.77 55.17,29.06 v55.35,28.88
  Bottom 0.254: v55.35,28.88 57.02,30.55 IC1.21
RXD  (via drill 0.61)
  Top 0.254: v49.84,40.82 49.84,33.53 50.8,32.56 62.01,32.56 62.03,32.54 65.61,32.54 74.12,24.03 90.55,24.03 v92.48,25.96 92.25,25.73
  Bottom 0.254: IC1.31 51.24,39.42 v49.84,40.82 | v92.48,25.96 92.48,24.36 103.17,13.66 103.17,9.15 SERIAL_ESP_MPU.2
RXE
  Bottom 0.254: 104.7,12.78 105.57,11.91 105.57,11.75 SERIAL_ESP_MPU.6 | 104.7,12.78 104.62,12.86 | U$1.7 116.84,28.42 115.57,29.69 106.84,29.69 106.83,29.69 103.1,29.69 101.62,28.22 101.62,23.19 103.97,20.84 104.01,20.84 104.63,20.23 104.63,13.77 104.7,13.7 104.7,12.78
SW  (via drill 0.61)
  Top 0.254: R9.2 112.55,55.88 112.55,52.7 R15.1 112.55,52.55 112.55,49.05 C5.2 112.39,48.9 97.53,48.9 89.78,41.15 79.78,41.15 78.89,40.26 78.89,34.37 78.26,33.73 69.98,33.73 69.98,31.9 71.22,30.66 71.74,30.66 v73.24,29.16
  Bottom 0.254: v73.24,29.16 72.85,28.77 72.85,26.34 71.77,25.26 71.77,25.2 71.49,24.92 54.61,24.92 53.66,23.97 53.66,5.55 FAN_LED.15
SWCLK  (via drill 0.61)
  Top 0.254: 68.02,31.11 67.87,31.11 | 68.02,31.11 68.57,31.11 v74.57,25.11 | 68.02,31.11 66.06,33.07 55.5,33.07 54.61,33.96 v54.61,42.86
  Bottom 0.254: v54.61,42.86 54.61,43.34 55.4,43.34 IC1.37 | JTAG.5 82.55,5.56 82.55,20.7 81.33,21.92 76.5,21.92 74.6,23.82 74.6,25.08 v74.57,25.11
SWDIO  (via drill 0.61)
  Top 0.254: v77.65,17.6 73.51,21.74 64.26,21.74 55.65,30.35 48.34,30.35 45.94,32.75 45.94,39.67 46.02,39.75 v46.02,40.84
  Bottom 0.254: IC1.34 51.28,40.92 50.34,41.86 47.04,41.86 v46.02,40.84 | v77.65,17.6 81.28,17.6 82.04,16.84 82.04,7.45 JTAG.7
SWLE
  Top 0.254: 59.21,13.49 59.21,13.92 | 59.21,13.92 59.21,16.83 R1.2 | 59.21,13.92 59.21,5.07 FAN_LED.11
TL1
  Bottom 0.254: L1.3 71.28,17.62 69.53,15.88 69.53,6.97 71.02,5.49 71.02,3.43 FAN_LED.2
TL2
  Bottom 0.254: L2.3 67.79,17.62 67.47,17.3 67.47,6.34 68.56,5.26 68.56,3.35 FAN_LED.4
TL3
  Bottom 0.254: L3.3 63.82,17.62 60.4,14.2 60.33,14.13 60.33,9.07 62.59,6.81 64.59,6.81 65.96,5.44 65.96,3.4 FAN_LED.6
TL4
  Bottom 0.254: L4.3 60.25,17.32 57.81,14.88 57.81,9.35 60.98,6.17 62.51,6.17 63.35,5.33 63.35,3.48 FAN_LED.8
TL5
  Bottom 0.254: 56.99,16.99 56.52,17.46 L5.3 56.52,9.68 60.83,5.36 60.83,3.45 FAN_LED.10
TX
  Top 0.254: JTAG.1 87.79,5.56 97.63,5.56 101.12,9.05 105.57,9.05 SERIAL_ESP_MPU.4
TX1  (via drill 0.61)
  Top 0.254: v71.57,31.5 72.46,32.38 87.27,32.38 v95.48,24.55
  Bottom 0.254: IC1.12 62.55,36.35 66.52,32.38 67.4,32.38 67.81,31.98 71.09,31.98 v71.57,31.5 | SERIAL_ESP_MPU.8 105.73,14.13 106.84,13.02 106.84,10.48 105.25,10.48 104.62,11.11 104.62,12.14 104.11,12.65 104.11,15.54 v95.48,24.55
TXB  (via drill 0.61)
  Top 0.254: 28.26,27.94 BT_H.4 29.89,27.86 33.83,31.8 34.05,31.8 34.17,31.91 44.21,31.91 47.27,28.85 v53.59,28.85
  Bottom 0.254: IC1.22 56.52,33.02 55.55,32.05 55.52,32.05 54,30.53 54,29.26 v53.59,28.85
TXD  (via drill 0.61)
  Top 0.254: v48.39,39.93 48.39,33.78 50.14,32.03 61.82,32.03 61.85,32 65.43,32 73.91,23.52 89.69,23.52 v90.4,22.81
  Bottom 0.254: IC1.30 49.4,38.92 v48.39,39.93 | SERIAL_ESP_MPU.1 108.28,6.59 108.28,4.27 105.16,1.14 93.22,1.14 92.73,1.63 92.73,7.8 93.7,8.76 93.7,10.64 93.41,10.93 93.41,10.95 91.95,12.41 91.95,12.83 91.64,13.13 91.64,13.21 90.4,14.45 v90.4,22.81
TXE
  Bottom 0.254: SERIAL_ESP_MPU.5 108.11,11.75 108.11,12.54 107.16,13.49 107.16,19.56 105.16,21.57 105.11,21.57 103.07,23.6 103.07,27.69 104.27,28.88 114.26,28.88 U$1.8
VDD  (via drill 0.61)
  Top 0.406: 46.33,19.68 45.72,19.68 arc-45 45.63,19.72 | 46.33,19.68 R14.1 56.84,20.95 arc-45 56.88,21.04 57.76,21.92 60.3,21.92 arc-45 60.39,21.88 61.62,20.65 61.62,19.91 arc-45 61.58,19.82 R24.1 R23.1 R22.1 68.98,19.81 arc-45 69.07,19.77 R21.1 R20.1 72.85,19.73 76.76,15.82 86.09,15.82 C10.+ 87.61,15.3 v89.41,17.09 | 29.34,23.01 28.51,23.01 arc45 28.42,22.98 BT_H.2 28.57,22.78 33.66,27.86 36.96,27.86 39.57,25.25 39.57,23.65 arc45 39.61,23.56 43.46,19.71 46.27,19.71 arc-45 46.33,19.68 | v130.89,44.65 128.87,42.63 116.04,42.63 arc-45 115.95,42.6 108.51,42.6 105.97,40.06 RELAY.1 | RELAY.1
  Top 0.508: 22.29,36.72 EXTRA.2 28.45,36.72 arc45 28.55,36.76 DD2_C.3 | 22.29,36.72 arc-45 22.2,36.76 19.66,39.29 19.66,44.65 arc-45 19.7,44.74 22.05,47.09 31.95,47.09 arc45 32.04,47.13 32.38,47.47 | 32.38,47.47 36.2,51.28 D2.C | DD3_C.3 arc45 33.97,45.89 32.38,47.47 | BT_H.2 27.21,22.78 arc-45 27.12,22.82 22.2,27.74 22.2,36.58 arc-45 22.24,36.67 22.29,36.72
  Bottom 0.406: 87.61,31.07 DD0_C.3 87.61,25.45 | 87.61,31.07 arc-45 87.65,31.16 | 87.61,25.45 arc45 87.65,25.36 DD1_C.3 | 87.61,25.45 87.64,25.42 arc-45 87.68,25.33 87.68,22.28 89.41,20.55 v89.41,17.09 | v130.89,44.65 133.07,46.84 133.07,49.51 SWIT.1 | 87.61,31.07 87.61,32.29 95.35,40.03 101.88,40.03 RELAY.1
  Bottom 0.508: D2.C 38.69,51.28 arc45 38.6,51.24 U3.3
VSS  (via drill 0.61)
  Top 0.254: 58.18,18.65 57.63,18.1 55.88,18.1 51.59,13.81 | 58.18,18.65 59.21,19.68 R1.1 | 42.55,47.31 R32.1 42.39,47.15 42.39,46.35 41.27,45.24 41.27,42.23 42.55,40.96 R28.1 41.33,39.55 41.33,36.5 v39.01,34.18 EXTRA.1 | 65.41,47.47 C17.2 | 58.18,18.65 58.26,18.57 72.23,18.57 v76.83,13.97 79.85,13.97 C12.- 83.72,13.97 v84.25,13.44 | v86.52,7.14 86.52,9.84 C10.- | C14.2 37.31,16.83 37.31,19.21 C9.2 37.31,19.37 37.31,21.59 C7.2 37.31,21.75 v38.89,21.75 42.18,18.47 49.78,18.47 51.51,16.74 51.51,15.62 | 28.26,25.4 BT_H.3 28.29,25.32 34.31,31.34 39.34,31.34 C2.1 39.93,30.61 C1.1 39.93,25.72 40.16,25.49 40.16,24.77 v41.35,23.57 | 65.35,47.58 C17.2 | v56.69,39.8 56.69,38.99 v58.06,37.62 | v56.69,39.8 58.06,39.8 v59.72,41.45 64.39,41.45 v65.41,42.47 | v56.69,39.8 58.95,39.8 v59.89,38.86 | C17.2 64.31,47.47 v62.94,46.1 | v79.5,19.74 92.28,19.74 94.51,21.97 96.52,21.97 103.05,28.5 103.07,28.5 106.02,31.45 | 80.47,38.86 80.8,38.53 v84.4,38.53 85.93,40.06 97.46,40.06 | 80.47,38.86 C15.2 | C16.2 80.24,38.64 80.47,38.86 | 37.96,2.35 RST_MPU1.4 | 31.42,2.35 RST_MPU1.4 | 31.42,2.35 RST_MPU1.3 | 31.42,2.35 28.19,5.58 PROGMODE.2 PROGMODE.1 | JTAG.4 JTAG.2 94.31,2.88 ESP_RST.3 ESP_RST.4 | 100.13,47.98 107.21,47.98 108.2,46.99 114.28,46.99 115.29,48.01 C5.1 115.41,49.05 115.41,52.55 R15.2 115.41,52.7 117.16,54.45 120.17,54.45 D1_C1.2 120.24,52.23 SWIT.5 | 100.13,47.98 100.03,47.98 97.28,45.24 97.28,40.23 97.46,40.06 | 106.02,31.45 113.54,38.96 121.44,38.96 v128.83,31.57 | 97.46,40.06 97.46,40.01 106.02,31.45 | 100.13,47.98 100.13,47.93 102.59,45.47 102.24,45.47 RELAY.3 | 41.05,13.54 C6.2 35.92,12.24 35.92,8.79 36.27,8.43 39.04,8.43 40.03,7.44 40.03,5.05 37.77,2.79 RST_MPU1.4
  Top 0.254: 41.05,13.54 FAN.4 | 51.51,15.62 51.51,13.89 51.59,13.81 | 51.51,6.24 51.51,7.52 53.9,9.91 | 53.9,9.91 53.9,11.51 51.59,13.81 | 41.05,13.54 41.05,14.48 42.01,15.44 51.33,15.44 51.51,15.62 | 51.5,6.22 51.51,6.24 | 51.51,6.24 51.51,5.16 FAN_LED.17 | 53.9,9.91 53.9,9.7 57.07,6.53 FAN_LED.13
  Bottom 0.254: U3.1 34.54,42.42 35.56,41.4 42.98,41.4 45.13,43.55 51.17,43.55 53.31,41.41 53.84,41.41 53.85,41.4 IC1.35 55.08,41.42 v56.69,39.8 | 86.52,6.88 86.52,4.13 87.63,3.02 JTAG.2 | 86.52,6.88 v86.52,7.14 | R7.2 34.61,24.13 34.61,21.75 v38.89,21.75 40.72,23.57 v41.35,23.57 | 127.16,22.38 R2.2 | 127.16,22.38 126.96,22.5 | R16.1 77.29,33.25 78.49,34.44 83.87,34.44 85.04,35.61 85.04,37.9 v84.4,38.53 | v58.06,37.62 57.28,37.62 56.03,36.37 56.03,34.93 IC1.23 | v59.72,41.45 59.82,41.45 60.52,42.15 60.52,43.2 | v59.89,38.86 60.68,38.86 61.13,38.42 IC1.8 | v65.41,42.47 65.41,44.55 C18.2 63.85,46.1 v62.94,46.1 | 77.27,19.87 L1.2 72.12,19.87 71.09,18.84 69.81,18.84 69.62,19.03 69.62,19.05 L2.2 68.54,19.9 67.51,18.86 66.23,18.86 65.2,19.9 L3.2 63.88,18.86 62.37,18.86 61.36,19.87 L4.2 60.97,19.87 59.94,18.84 58.66,18.84 57.68,19.82 L5.2 | 77.27,19.87 79.37,19.87 v79.5,19.74 | C8.2 101.24,9.96 104.34,6.86 104.34,5.35 ESP_RST.4 | 127.16,22.38 128.86,24.09 U$1.1 128.83,28.31 v128.83,31.57 | v84.25,13.44 84.25,9.15 86.52,6.88 | D1_C.2 41.06,32.12 v39.01,34.18 | 77.27,19.87 77.27,18.41 76.81,17.95 76.81,17.25 76.83,17.23 v76.83,13.97 | R17.1 31.4,31.01 EXTRA.1 | 60.52,43.2 60.5,43.18 | IC1.47 60.52,43.2 | 126.82,22.05 127.16,22.38
  Bottom 0.305: BOOT/FLASH.2 108.28,19.55 110.95,22.22 127,22.22 127.16,22.38
  Bottom 0.406: U3.1 33.38,42.44 arc-45 33.29,42.48 30.05,45.72 25.02,45.72 arc45 24.93,45.68 21.16,41.91 21.16,36.93 arc45 21.2,36.84 23.93,34.11 28.11,34.11 arc45 28.2,34.15 EXTRA.1 24.73,34.18 23.52,32.97 23.52,29.39 27.58,25.32
  Bottom 0.508: U$2.P$2 24.82,23.09 arc45 24.91,23.13 27.1,25.32 27.58,25.32 BT_H.3 arc-45 BT_H.3
  pour Top (isolate 0.61): 14.12,46.99 33.12,46.99 arc45 33.21,47.03 36.25,50.06 103.78,50.06 arc90 103.91,50.19 103.91,59 134.62,59 arc-90 134.75,58.88 134.75,20.17 110.03,20.17 arc90 109.91,20.04 109.65,-0.33 24.71,-0.33 arc-90 24.84,0.25 24.84,20.02 14.27,20.02 arc-90 14.15,20.14
  pour Bottom: 13.82,47.07 33.2,47.07 36.22,50.09 103.84,50.09 103.84,59.03 134.87,59.03 134.87,20.04 109.86,20.04 109.86,-0.46 24.69,-0.46 24.69,20.04 13.79,20.04